# Altium schematic sheet SDRAMModule.SchDoc
size A4; SheetNumber: 5; SheetTotal: 8
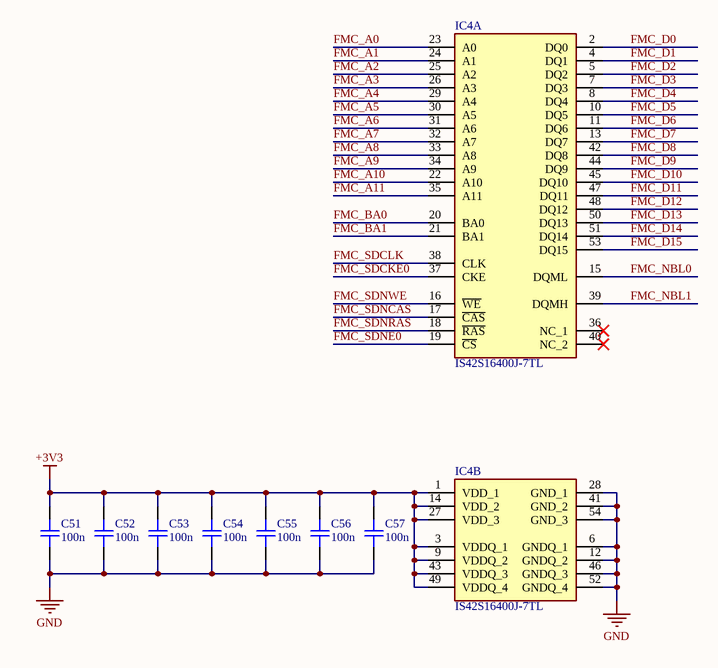
[diagram p0: SDRAMModule.SchDoc]

## Parts
C51  100n  [CAP_0402]
C52  100n  [CAP_0402]
C53  100n  [CAP_0402]
C54  100n  [CAP_0402]
C55  100n  [CAP_0402]
C56  100n  [CAP_0402]
C57  100n  [CAP_0402]
IC4  IS42S16400J-7TL  [SOP80P1176X120-54N]  (parts A,B of 2)

## Nets
+3V3: C51.2 C52.2 C53.2 C54.2 C55.2 C56.2 C57.2 IC4.1(VDD_1) IC4.3(VDDQ_1) IC4.9(VDDQ_2) IC4.14(VDD_2) IC4.27(VDD_3) IC4.43(VDDQ_3) IC4.49(VDDQ_4)
GND: C51.1 C52.1 C53.1 C54.1 C55.1 C56.1 C57.1 IC4.6(GNDQ_1) IC4.12(GNDQ_2) IC4.28(GND_1) IC4.41(GND_2) IC4.46(GNDQ_3) IC4.52(GNDQ_4) IC4.54(GND_3)
FMC_A0: IC4.23(A0)
FMC_A1: IC4.24(A1)
FMC_A2: IC4.25(A2)
FMC_A3: IC4.26(A3)
FMC_A4: IC4.29(A4)
FMC_A5: IC4.30(A5)
FMC_A6: IC4.31(A6)
FMC_A7: IC4.32(A7)
FMC_A8: IC4.33(A8)
FMC_A9: IC4.34(A9)
FMC_A10: IC4.22(A10)
FMC_A11: IC4.35(A11)
FMC_BA0: IC4.20(BA0)
FMC_BA1: IC4.21(BA1)
FMC_D0: IC4.2(DQ0)
FMC_D1: IC4.4(DQ1)
FMC_D2: IC4.5(DQ2)
FMC_D3: IC4.7(DQ3)
FMC_D4: IC4.8(DQ4)
FMC_D5: IC4.10(DQ5)
FMC_D6: IC4.11(DQ6)
FMC_D7: IC4.13(DQ7)
FMC_D8: IC4.42(DQ8)
FMC_D9: IC4.44(DQ9)
FMC_D10: IC4.45(DQ10)
FMC_D11: IC4.47(DQ11)
FMC_D12: IC4.48(DQ12)
FMC_D13: IC4.50(DQ13)
FMC_D14: IC4.51(DQ14)
FMC_D15: IC4.53(DQ15)
FMC_NBL0: IC4.15(DQML)
FMC_NBL1: IC4.39(DQMH)
FMC_SDCKE0: IC4.37(CKE)
FMC_SDCLK: IC4.38(CLK)
FMC_SDNCAS: IC4.17(~{CAS})
FMC_SDNE0: IC4.19(~{CS})
FMC_SDNRAS: IC4.18(~{RAS})
FMC_SDNWE: IC4.16(~{WE})

Not connected (* = marked no-connect by the designer): IC4 36(NC_1)* 40(NC_2)*

## Library data of the parts
C51-C57 = CAP_0402: Capacitor SMD 0402; Manufacturer: *; Manufacturer Part Number: *; Distributor Link: *; LCSC: *; Rating: *; Dielectric: *
IC4 = IS42S16400J-7TL: Integrated Circuit; Manufacturer_Name: Integrated Silicon Solution Inc.; Datasheet Link: http://www.issi.com/WW/pdf/42-45S16400J.pdf; Height: 1.2mm; Manufacturer_Part_Number: IS42S16400J-7TL; Mouser Part Number: 870-IS42S16400J-7TL; Mouser Price/Stock: https://www.mouser.co.uk/ProductDetail/ISSI/IS42S16400J-7TL?qs=eOmjsnl%2FhF6%2FoT1%252B3blFIA%3D%3D; Arrow Part Number: IS42S16400J-7TL; Arrow Price/Stock: https://www.arrow.com/en/products/is42s16400j-7tl/integrated-silicon-solution-inc?region=europe